# Altium project PCB_Game_consol.PrjPCB
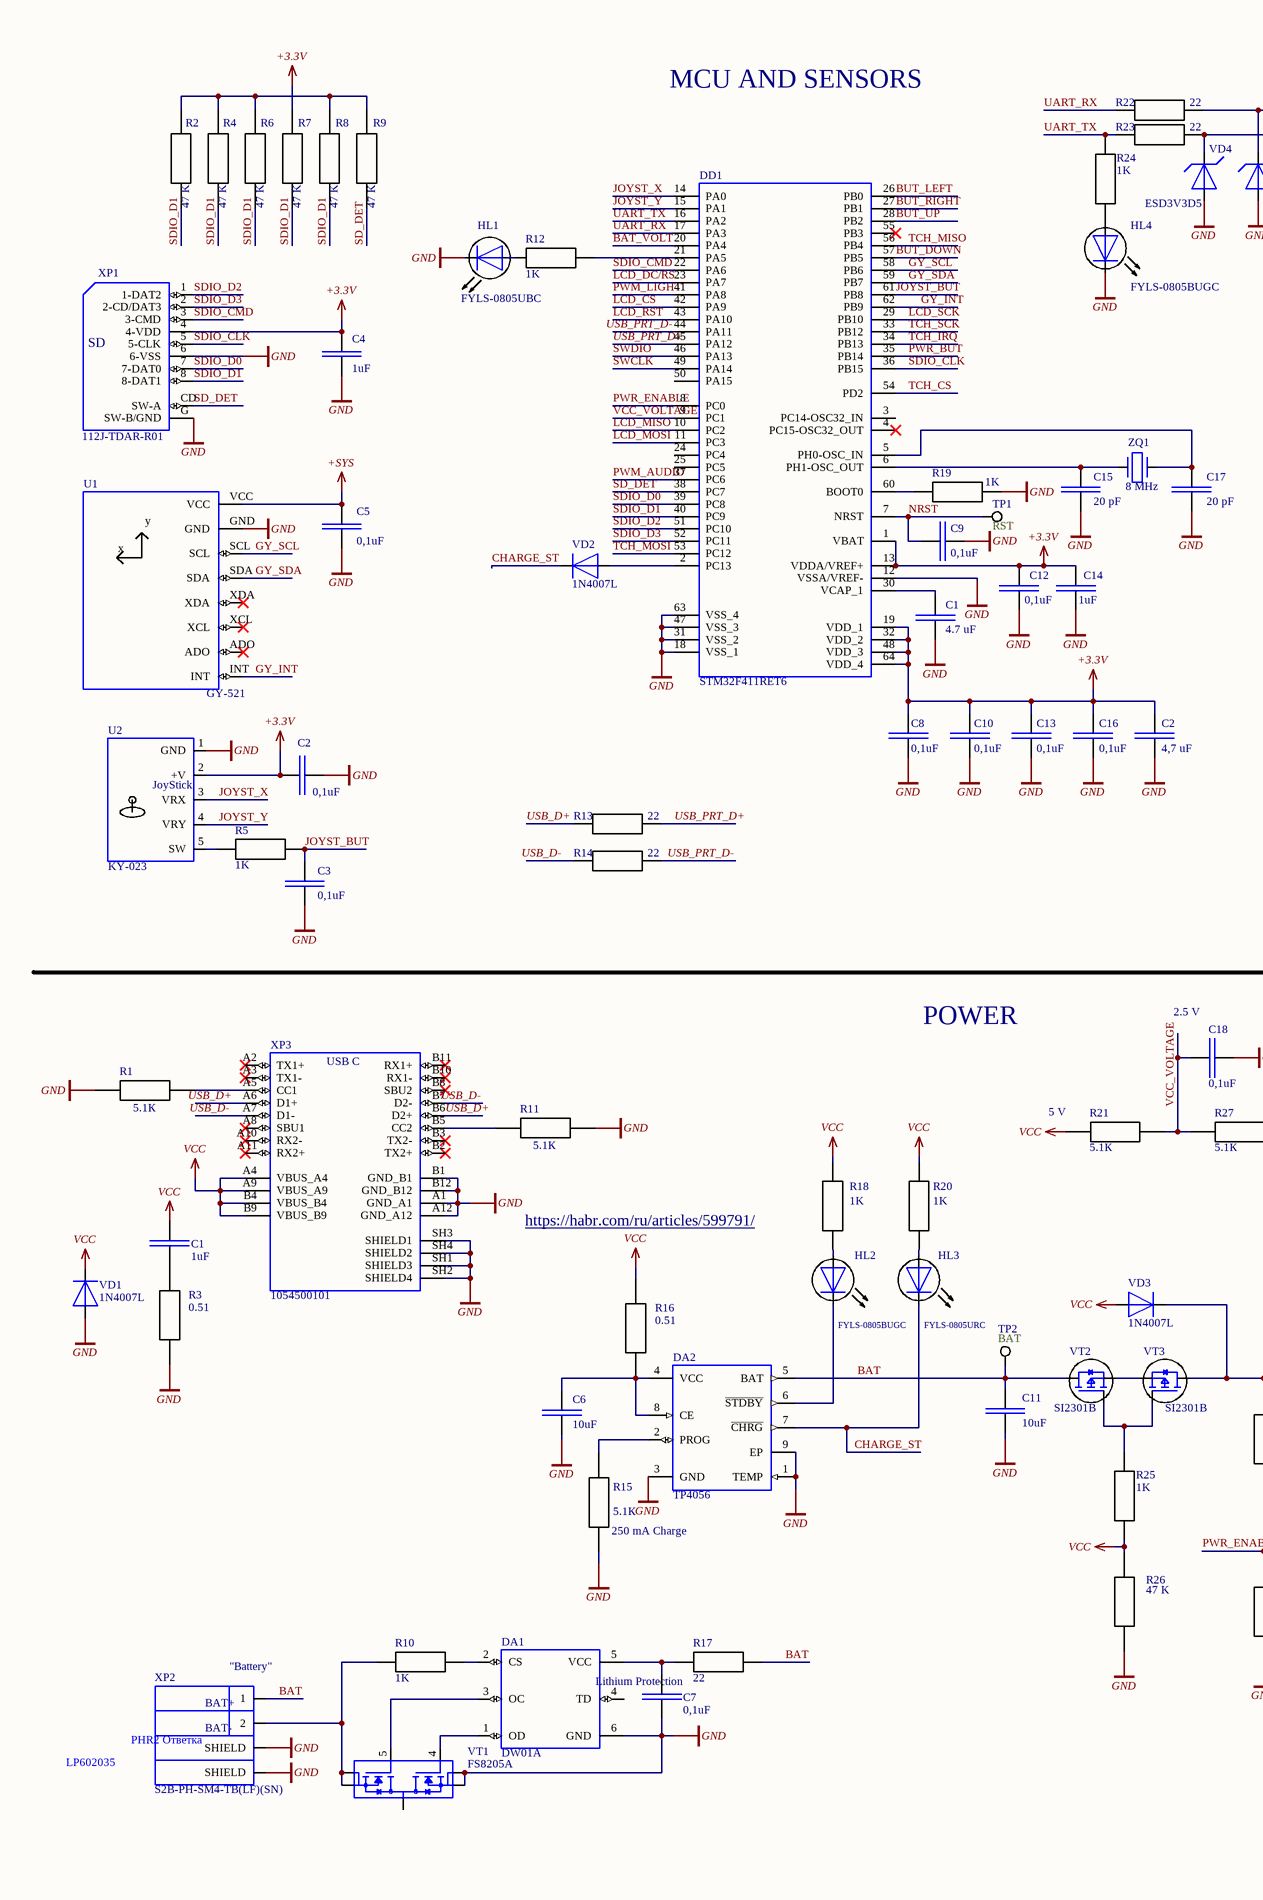
[diagram p0: Sheet_GameConsol.SchDoc, left]
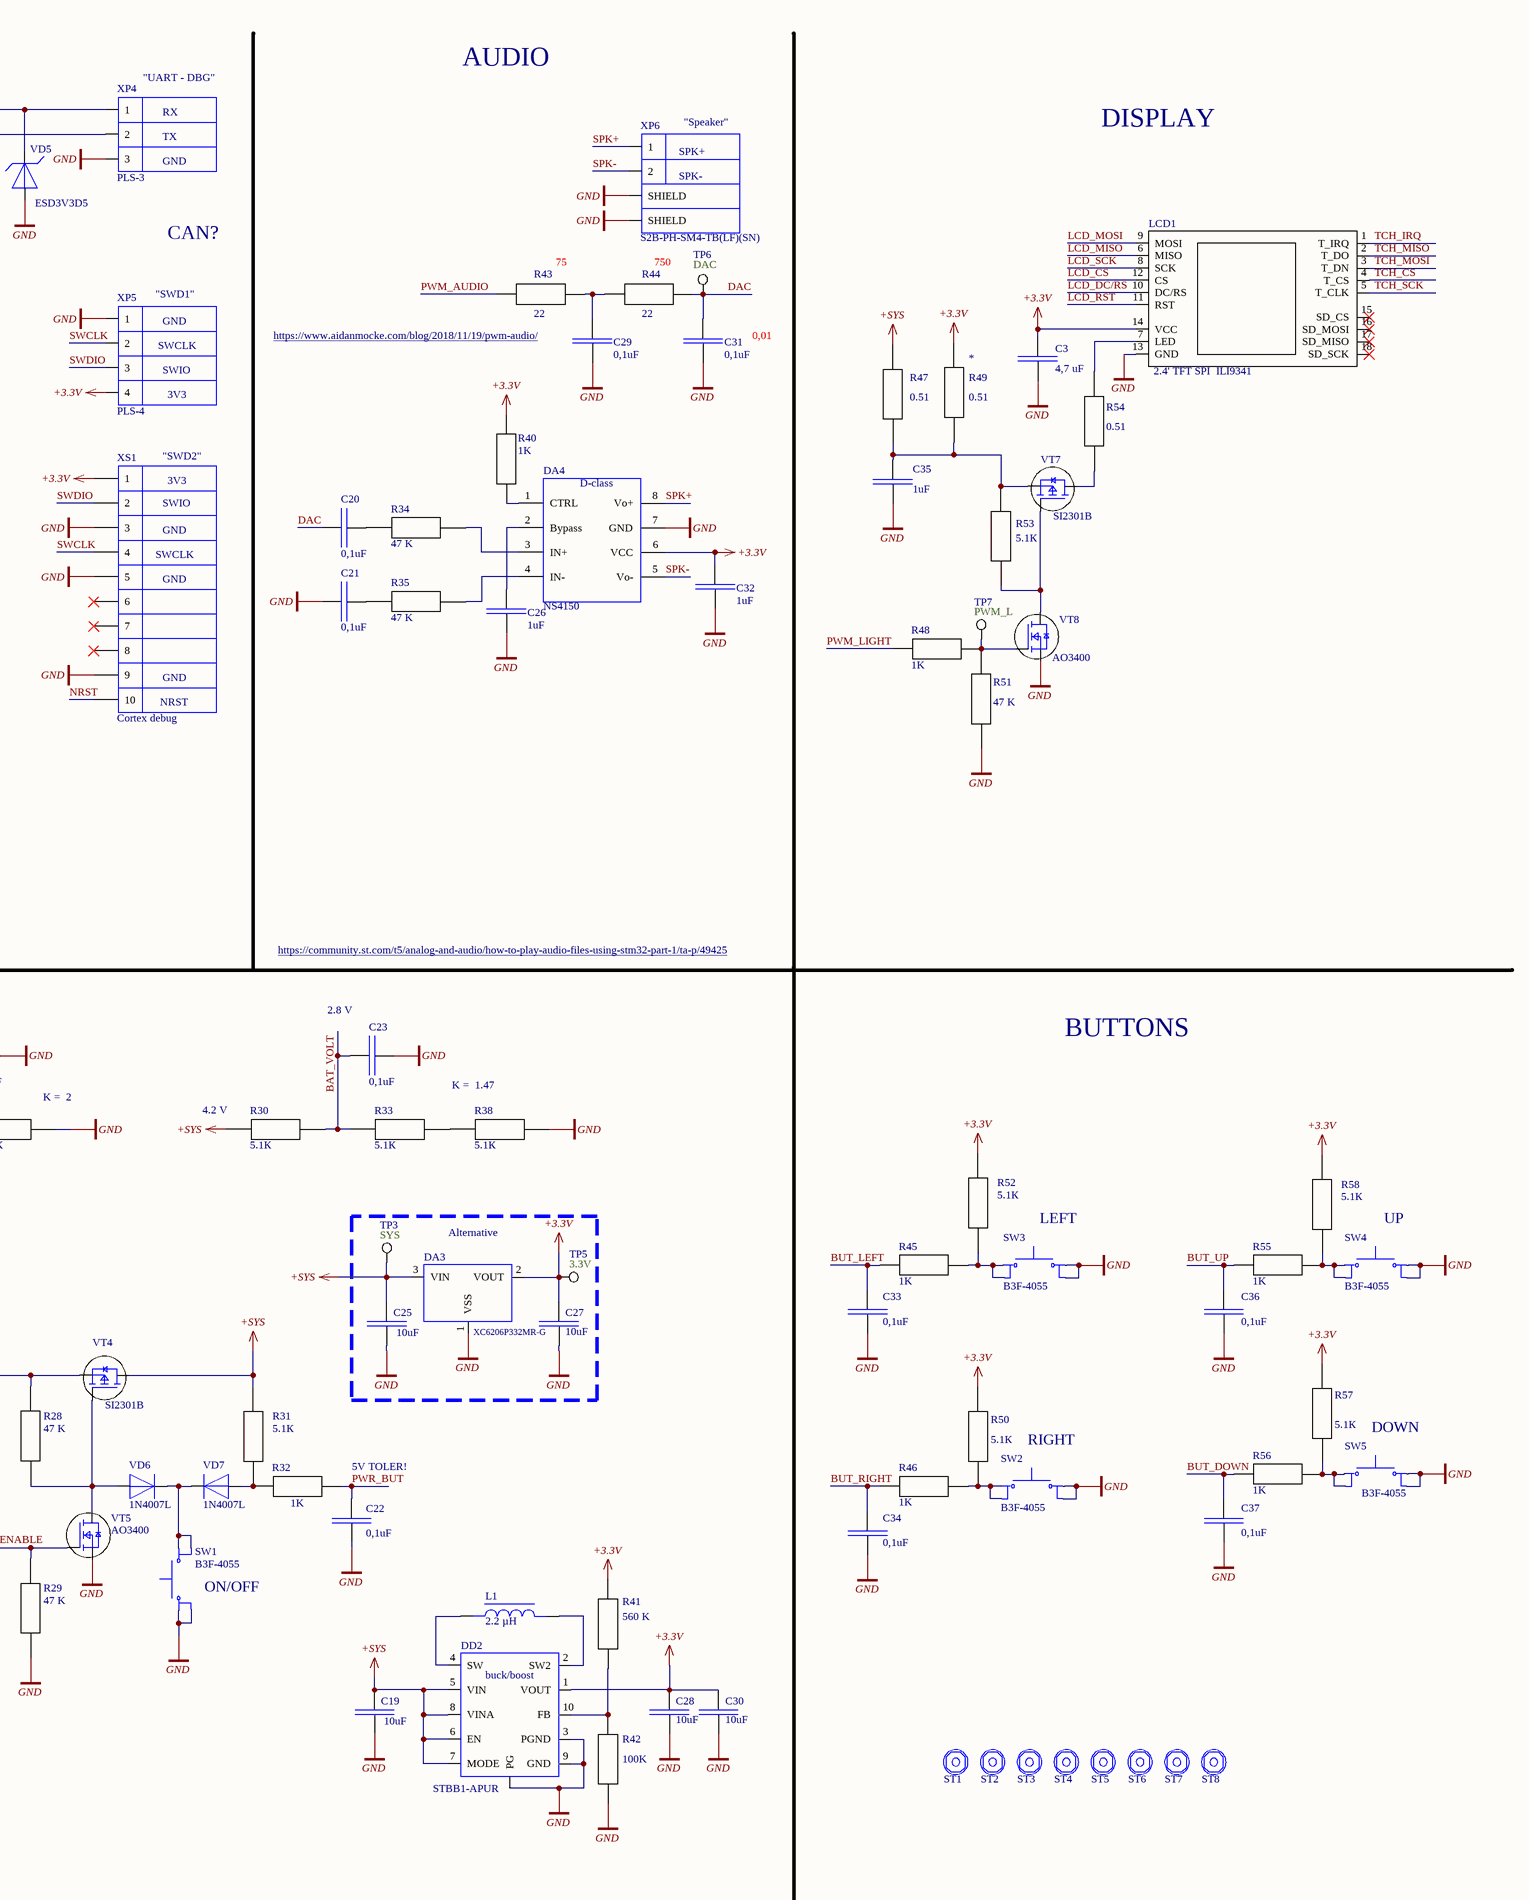
[diagram p1: Sheet_GameConsol.SchDoc, right]
1 sheet, 149 parts. Net scope: global (net labels, ports and power ports of the same name join across sheets).
Board file: PCB_Console.PcbDoc

## Sheet Sheet_GameConsol.SchDoc: Game Console
size A2; Organization: Altium Limited; Address4: Australia 2086; Time: 2023

### Parts
C1  1uF  [CAPC2012X70]
C2  0,1uF  [CAPC1608X90]
C3  0,1uF  [CAPC1608X90]
C4  1uF  [CAPC2012X70]
C5  0,1uF  [CAPC1608X90]
C6  10uF  [CAPC1608X90]
C7  0,1uF  [CAPC1608X90]
C8  0,1uF  [CAPC1608X90]
C9  0,1uF  [CAPC1608X90]
C10  0,1uF  [CAPC1608X90]
C11  10uF  [CAPC1608X90]
C12  0,1uF  [CAPC1608X90]
C13  0,1uF  [CAPC1608X90]
C14  1uF  [CAPC2012X70]
C15  20 pF  [CAPC2012X70]
C16  0,1uF  [CAPC1608X90]
C17  20 pF  [CAPC2012X70]
C18  0,1uF  [CAPC1608X90]
C19  10uF  [CAPC1608X90]
C20  0,1uF  [CAPC1608X90]
C21  0,1uF  [CAPC1608X90]
C22  0,1uF  [CAPC1608X90]
C23  0,1uF  [CAPC1608X90]
C25  10uF  [CAPC1608X90]
C26  1uF  [CAPC2012X70]
C27  10uF  [CAPC1608X90]
C28  10uF  [CAPC1608X90]
C29  0,1uF  [CAPC1608X90]
C30  10uF  [CAPC1608X90]
C31  0,1uF  [CAPC1608X90]
C32  1uF  [CAPC2012X70]
C33  0,1uF  [CAPC1608X90]
C34  0,1uF  [CAPC1608X90]
C35  1uF  [CAPC2012X70]
C36  0,1uF  [CAPC1608X90]
C37  0,1uF  [CAPC1608X90]
DA1  DW01A  [SOT23-6]
DA2  TP4056  [SOP127P600X175-9N]
DA3  XC6206P332MR-G  [SOT-23]
DA4  NS4150  [SOIC127P780X200-8N]
DD1  STM32F411RET6  [QFP50P1200X1200X160-64N]
DD2  STBB1-APUR  [10-VFDFN]
HL1  FYLS-0805UBC  [0805 Chip SMD LED]
HL2  FYLS-0805BUGC  [0805 Chip SMD LED]
HL3  FYLS-0805URC  [0805 Chip SMD LED]
HL4  FYLS-0805BUGC  [0805 Chip SMD LED]
L1  2.2 µH  [IND_VLCF4020T-2R2N1R7]
LCD1  2.4' TFT SPI  ILI9341  [ILI9341 TFT DISPLAY]
R1  5.1К  [RESC1607X60N]
R2  47 K  [0805_res]
R3  0.51  [0805_res]
R4  47 K  [0805_res]
R5  1K  [RESC1607X60N]
R6  47 K  [0805_res]
R7  47 K  [0805_res]
R8  47 K  [0805_res]
R9  47 K  [0805_res]
R10  1K  [RESC1607X60N]
R11  5.1К  [RESC1607X60N]
R12  1K  [RESC1607X60N]
R13  22  [RESC1607X60N]
R14  22  [RESC1607X60N]
R15  5.1К  [RESC1607X60N]
R16  0.51  [0805_res]
R17  22  [RESC1607X60N]
R18  1K  [RESC1607X60N]
R19  1K  [RESC1607X60N]
R20  1K  [RESC1607X60N]
R21  5.1К  [RESC1607X60N]
R22  22  [RESC1607X60N]
R23  22  [RESC1607X60N]
R24  1K  [RESC1607X60N]
R25  1K  [RESC1607X60N]
R26  47 K  [0805_res]
R27  5.1К  [RESC1607X60N]
R28  47 K  [0805_res]
R29  47 K  [0805_res]
R30  5.1К  [RESC1607X60N]
R31  5.1К  [RESC1607X60N]
R32  1K  [RESC1607X60N]
R33  5.1К  [RESC1607X60N]
R34  47 K  [0805_res]
R35  47 K  [0805_res]
R38  5.1К  [RESC1607X60N]
R40  1K  [RESC1607X60N]
R41  560 K  [0805_res]
R42  100K  [0805_res]
R43  22  [RESC1607X60N]
R44  22  [RESC1607X60N]
R45  1K  [RESC1607X60N]
R46  1K  [RESC1607X60N]
R47  0.51  [0805_res]
R48  1K  [RESC1607X60N]
R49  0.51  [0805_res]
R50  5.1К  [RESC1607X60N]
R51  47 K  [0805_res]
R52  5.1К  [RESC1607X60N]
R53  5.1К  [RESC1607X60N]
R54  0.51  [0805_res]
R55  1K  [RESC1607X60N]
R56  1K  [RESC1607X60N]
R57  5.1К  [RESC1607X60N]
R58  5.1К  [RESC1607X60N]
ST1  M3 Standoff 5+10mm  [Standoff_M3_5mm+10mm_pcb]  (value not drawn)
ST2  M3 Standoff 5+10mm  [Standoff_M3_5mm+10mm_pcb]  (value not drawn)
ST3  M3 Standoff 5+10mm  [Standoff_M3_5mm+10mm_pcb]  (value not drawn)
ST4  M3 Standoff 5+10mm  [Standoff_M3_5mm+10mm_pcb]  (value not drawn)
ST5  M3 Standoff 5+10mm  [Standoff_M3_5mm+10mm_pcb]  (value not drawn)
ST6  M3 Standoff 5+10mm  [Standoff_M3_5mm+10mm_pcb]  (value not drawn)
ST7  M3 Standoff 5+10mm  [Standoff_M3_5mm+10mm_pcb]  (value not drawn)
ST8  M3 Standoff 5+10mm  [Standoff_M3_5mm+10mm_pcb]  (value not drawn)
SW1  B3F-4055  [SW_B3F-4055]
SW2  B3F-4055  [SW_B3F-4055]
SW3  B3F-4055  [SW_B3F-4055]
SW4  B3F-4055  [SW_B3F-4055]
SW5  B3F-4055  [SW_B3F-4055]
TP1  RST  [Test Point]
TP2  BAT  [Test Point]
TP3  SYS  [Test Point]
TP5  3.3V  [Test Point]
TP6  DAC  [Test Point]
TP7  PWM_L  [Test Point]
U1  GY-521  [GY-521]  (value not drawn)
U2  KY-023  [KY-023_PCB]
VD1  1N4007L  [SOD3715X135N]
VD2  1N4007L  [SOD3715X135N]
VD3  1N4007L  [SOD3715X135N]
VD4  ESD3V3D5  [SOD-523_PCB]
VD5  ESD3V3D5  [SOD-523_PCB]
VD6  1N4007L  [SOD3715X135N]
VD7  1N4007L  [SOD3715X135N]
VT1  FS8205A  [SOP65P640X120-8N]
VT2  SI2301B  [SOT95P240X111-3N]
VT3  SI2301B  [SOT95P240X111-3N]
VT4  SI2301B  [SOT95P240X111-3N]
VT5  AO3400  [SOT95P240X111-3N]
VT7  SI2301B  [SOT95P240X111-3N]
VT8  AO3400  [SOT95P240X111-3N]
XP1  112J-TDAR-R01  [112J-TDAR-R01]
XP2  S2B-PH-SM4-TB(LF)(SN)  [JST_S2B-PH-SM4-TB(LF)(SN)]
XP3  1054500101  [MOLEX_1054500101]
XP4  PLS-3  [PLS-3_PCB]
XP5  PLS-4  [PLS-4_PCB]
XP6  S2B-PH-SM4-TB(LF)(SN)  [JST_S2B-PH-SM4-TB(LF)(SN)]
XS1  Cortex debug  [SAMTEC_FTSH-105-01-L-DV-K]
ZQ1  8 MHz  [HC-49SM_PCB]
С1  4.7 uF  [CAPC2012X70]
С2  4,7 uF  [CAPC2012X70]
С3  4,7 uF  [CAPC2012X70]

### Blocks framed on the sheet
Alternative: C25 C27 DA3 TP3 TP5

### Nets
+3.3V: C2.2 C4.2 C8.2 C10.2 C12.2 C13.2 C14.2 C16.2 C27.2 C28.2 C30.2 C32.1 DA3.2(VOUT) DA4.6(VCC) DD1.1(VBAT) DD1.13(VDDA/VREF+) DD1.19(VDD_1) DD1.32(VDD_2) DD1.48(VDD_3) DD1.64(VDD_4) DD2.1(VOUT) LCD1.14(VCC) R7.2 R40.1 R41.2 R49.2 R50.2 R52.2 R57.2 R58.2 TP5.1 U2.2(+V) XP1.4(4-VDD) XP5.4 XS1.1 С2.2 С3.2
+SYS: C5.2 C19.2 C25.2 DA3.3(VIN) DD2.5(VIN) DD2.6(EN) DD2.7(MODE) DD2.8(VINA) R30.1 R31.2 R47.2 TP3.1 U1.VCC VT4.3(D)
GND: C2.1 C3.1 C4.1 C5.1 C6.1 C7.1 C8.1 C9.1 C10.1 C11.1 C12.1 C13.1 C14.1 C15.1 C16.1 C17.1 C18.1 C19.1 C21.2 C22.1 C23.1 C25.1 C26.2 C27.1 C28.1 C29.1 C30.1 C31.1 C32.2 C33.1 C34.1 C35.1 C36.1 C37.1 DA1.6(GND) DA2.1(TEMP) DA2.3(GND) DA2.9(EP) DA3.1(VSS) DA4.7(GND) DD1.12(VSSA/VREF-) DD1.18(VSS_1) DD1.31(VSS_2) DD1.47(VSS_3) DD1.63(VSS_4) DD2.3(PGND) DD2.9(GND) DD2.PG HL1.C(K) HL4.C(K) LCD1.13(GND) R1.2 R3.1 R11.2 R15.1 R19.2 R26.1 R27.1 R29.1 R38.1 R42.1 R51.1 SW1.1(COM) SW1.2(COM) SW2.3(NO) SW2.4(NO) SW3.3(NO) SW3.4(NO) SW4.3(NO) SW4.4(NO) SW5.3(NO) SW5.4(NO) U1.GND U2.1(GND) VD1.A VD4.A VD5.A VT1.2(S1) VT1.3(S1) VT5.2(S) VT8.2(S) XP1.6(6-VSS) XP1.G(SW-B/GND) XP2.S1(SHIELD) XP2.S2(SHIELD) XP3.A1(GND_A1) XP3.A12(GND_A12) XP3.B1(GND_B1) XP3.B12(GND_B12) XP3.SH1(SHIELD3) XP3.SH2(SHIELD4) XP3.SH3(SHIELD1) XP3.SH4(SHIELD2) XP4.3 XP5.1 XP6.S1(SHIELD) XP6.S2(SHIELD) XS1.3 XS1.5 XS1.9 С1.2 С2.1 С3.1
VCC: C1.2 R16.2 R18.2 R20.2 R21.1 R25.1 R26.2 VD1.C(K) VD3.A XP3.A4(VBUS_A4) XP3.A9(VBUS_A9) XP3.B4(VBUS_B4) XP3.B9(VBUS_B9)
BAT: C11.2 DA2.5(BAT) R17.1 TP2.1 VT2.3(D) XP2.1
BAT_VOLT: C23.2 DD1.20(PA4) R30.2 R33.2
BUT_DOWN: C37.2 DD1.57(PB5) R56.1
BUT_LEFT: C33.2 DD1.26(PB0) R45.1
BUT_RIGHT: C34.2 DD1.27(PB1) R46.1
BUT_UP: C36.2 DD1.28(PB2) R55.1
CHARGE_ST: DA2.7(~{CHRG}) HL3.C(K) VD2.C(K)
DAC: C20.2 C31.2 R44.1 TP6.1
GY_INT: DD1.62(PB9) U1.INT
GY_SCL: DD1.58(PB6) U1.SCL
GY_SDA: DD1.59(PB7) U1.SDA
JOYST_BUT: C3.2 DD1.61(PB8) R5.1
JOYST_X: DD1.14(PA0) U2.3(VRX)
JOYST_Y: DD1.15(PA1) U2.4(VRY)
LCD_CS: DD1.42(PA9) LCD1.12(CS)
LCD_DC/RS: DD1.23(PA7) LCD1.10(DC/RS)
LCD_MISO: DD1.10(PC2) LCD1.6(MISO)
LCD_MOSI: DD1.11(PC3) LCD1.9(MOSI)
LCD_RST: DD1.43(PA10) LCD1.11(RST)
LCD_SCK: DD1.29(PB10) LCD1.8(SCK)
NRST: C9.2 DD1.7(NRST) TP1.1 XS1.10
PWM_AUDIO: DD1.37(PC6) R43.2
PWM_LIGHT: DD1.41(PA8) R48.2
PWR_BUT: C22.2 DD1.35(PB14) R32.2
PWR_ENABLE: DD1.8(PC0) R29.2 VT5.1(G)
SD_DET: DD1.38(PC7) R9.1 XP1.CD(SW-A)
SDIO_CLK: DD1.36(PB15) XP1.5(5-CLK)
SDIO_CMD: DD1.22(PA6) XP1.3(3-CMD)
SDIO_D0: DD1.39(PC8) XP1.7(7-DAT0)
SDIO_D1: DD1.40(PC9) R2.1 R4.1 R6.1 R7.1 R8.1 XP1.8(8-DAT1)
SDIO_D2: DD1.51(PC10) XP1.1(1-DAT2)
SDIO_D3: DD1.52(PC11) XP1.2(2-CD/DAT3)
SPK+: DA4.8(Vo+) XP6.1
SPK-: DA4.5(Vo-) XP6.2
SWCLK: DD1.49(PA14) XP5.2 XS1.4
SWDIO: DD1.46(PA13) XP5.3 XS1.2
TCH_CS: DD1.54(PD2) LCD1.4(T_CS)
TCH_IRQ: DD1.34(PB13) LCD1.1(T_IRQ)
TCH_MISO: DD1.56(PB4) LCD1.2(T_DO)
TCH_MOSI: DD1.53(PC12) LCD1.3(T_DN)
TCH_SCK: DD1.33(PB12) LCD1.5(T_CLK)
UART_RX: DD1.17(PA3) R22.1
UART_TX: DD1.16(PA2) R23.1 R24.2
USB_D+: R13.1 XP3.A6(D1+) XP3.B6(D2+)
USB_D-: R14.1 XP3.A7(D1-) XP3.B7(D2-)
USB_PRT_D+: DD1.45(PA12) R13.2
USB_PRT_D-: DD1.44(PA11) R14.2
VCC_VOLTAGE: C18.2 DD1.9(PC1) R21.2 R27.2
NetC1_1: C1.1 R3.2
NetC6_2: C6.2 DA2.4(VCC) DA2.8(CE) R16.1
NetC7_2: C7.2 DA1.5(VCC) R17.2
NetC15_2: C15.2 DD1.6(PH1-OSC_OUT) ZQ1.1
NetC17_2: C17.2 DD1.5(PH0-OSC_IN) ZQ1.2
NetC20_1: C20.1 R34.2
NetC21_1: C21.1 R35.2
NetC26_1: C26.1 DA4.2(Bypass)
NetC29_2: C29.2 R43.1 R44.2
NetC35_2: C35.2 R47.1 R49.1 R53.2 VT7.2(S)
NetDA1_1: DA1.1(OD) VT1.4(G1)
NetDA1_2: DA1.2(CS) R10.2
NetDA1_3: DA1.3(OC) VT1.5(G2)
NetDA2_2: DA2.2(PROG) R15.2
NetDA2_6: DA2.6(~{STDBY}) HL2.C(K)
NetDA4_1: DA4.1(CTRL) R40.2
NetDA4_3: DA4.3(IN+) R34.1
NetDA4_4: DA4.4(IN-) R35.1
NetDD1_2: DD1.2(PC13) VD2.A
NetDD1_21: DD1.21(PA5) R12.2
NetDD1_30: DD1.30(VCAP_1) С1.1
NetDD1_60: DD1.60(BOOT0) R19.1
NetDD2_2: DD2.2(SW2) L1.2
NetDD2_4: DD2.4(SW) L1.1
NetDD2_10: DD2.10(FB) R41.1 R42.2
NetHL1_A: HL1.A R12.1
NetHL2_A: HL2.A R18.1
NetHL3_A: HL3.A R20.1
NetHL4_A: HL4.A R24.1
NetLCD1_7: LCD1.7(LED) R54.2
NetR1_1: R1.1 XP3.A5(CC1)
NetR2_2: R2.2 R4.2 R6.2 R8.2 R9.2
NetR5_2: R5.2 U2.5(SW)
NetR10_1: R10.1 VT1.6(S2) VT1.7(S2) XP2.2
NetR11_1: R11.1 XP3.B5(CC2)
NetR22_2: R22.2 VD5.C(K) XP4.1
NetR23_2: R23.2 VD4.C(K) XP4.2
NetR25_2: R25.2 VT2.1(G) VT3.1(G)
NetR28_1: R28.1 VD6.A VT4.1(G) VT5.3(D)
NetR28_2: R28.2 VD3.C(K) VT3.3(D) VT4.2(S)
NetR31_1: R31.1 R32.1 VD7.A
NetR33_1: R33.1 R38.2
NetR45_2: R45.2 R52.1 SW3.1(COM) SW3.2(COM)
NetR46_2: R46.2 R50.1 SW2.1(COM) SW2.2(COM)
NetR48_1: R48.1 R51.2 TP7.1 VT8.1(G)
NetR53_1: R53.1 VT7.1(G) VT8.3(D)
NetR54_1: R54.1 VT7.3(D)
NetR55_2: R55.2 R58.1 SW4.1(COM) SW4.2(COM)
NetR56_2: R56.2 R57.1 SW5.1(COM) SW5.2(COM)
NetSW1_3: SW1.3(NO) SW1.4(NO) VD6.C(K) VD7.C(K)
NetVT1_1: VT1.1(D12) VT1.8(D12)
NetVT2_2: VT2.2(S) VT3.2(S)

Not connected (* = marked no-connect by the designer): DA1 4(TD); DD1 3(PC14-OSC32_IN) 4(PC15-OSC32_OUT)* 24(PC4) 25(PC5) 50(PA15) 55(PB3)*; LCD1 15(SD_CS)* 16(SD_MOSI)* 17(SD_MISO)* 18(SD_SCK)*; U1 ADO* XCL* XDA*; XP3 A2(TX1+)* A3(TX1-)* A8(SBU1)* A10(RX2-)* A11(RX2+)* B2(TX2+)* B3(TX2-)* B8(SBU2)* B10(RX1-)* B11(RX1+)*; XS1 6* 7* 8*

### Notes on the sheet
- MCU AND SENSORS
- (near XP4) "UART - DBG"
- AUDIO
- (near XP4) GND
- (near XP4) TX
- (near XP4) RX
- (near XP6) SPK+
- (near XP6) "Speaker"
- DISPLAY
- (near XP6) SPK-
- CAN?
- (near R43) 75
- 750
- (near XP5) "SWD1"
- (near XP5) SWCLK
- (near XP5) GND
- (near C29) https://www.aidanmocke.com/blog/2018/11/19/pwm-audio/
- 0,01
- (near XP5) SWIO
- (near XP5) 3V3
- (near R49) *
- "SWD2"
- (near XS1) GND
- (near XS1) SWIO
- (near XS1) 3V3
- (near XS1) SWCLK
- (near XS1) NRST
- https://community.st.com/t5/analog-and-audio/how-to-play-audio-files-using-stm32-part-1/ta-p/49425
- POWER
- (near C18) 2.5 V
- (near C23) 2.8 V
- BUTTONS
- (near R27) K =  2
- K =  1.47
- (near R21) 5 V
- (near R30) 4.2 V
- (near R18) https://habr.com/ru/articles/599791/
- (near SW3) LEFT
- (near SW4) UP
- 5V TOLER!
- RIGHT
- DOWN
- (near R15) 250 mA Charge
- (near SW1) ON/OFF
- (near XP2) "Battery"
- (near XP2) BAT+
- (near XP2) BAT-
- LP602035
- PHR2 Ответка
- Title
- Size:
- Date:
- File:
- A2
- Number:
- Time:
- Revision:
- Sheet
- of
- (in symbol 112J-TDAR-R01) SD
- (in symbol 1054500101) USB C
- (in symbol DW01A) Lithium Protection
- (in symbol GY-521) y; x
- (in symbol KY-023) JoyStick
- (in symbol NS4150) D-class
- (in symbol STBB1-APUR) buck/boost

### Library data of the parts
C1 C4 C14 C26 C32 C35 = CC0805KKX7R8BB105: CC0805KKX7R8BB105, Керамический ЧИП-конденсатор 0805 X7R 1мкФ ±10% 25В; MF: Yageo; Digi-Key_Part_Number: 311-1456-1-ND; Package: 0805 Yageo; Check_prices: https://www.snapeda.com/parts/CC0805KKX7R8BB105/Yageo/view-part/105544/?ref=eda; SnapEDA_Link: https://www.snapeda.com/parts/CC0805KKX7R8BB105/Yageo/view-part/105544/?ref=snap; MP: CC0805KKX7R8BB105; Value: *; Purchase-URL: https://pricing.snapeda.com/search/part/CC0805KKX7R8BB105/?ref=eda
C2 C3 C5 C7-C10 C12 C13 C16 C18 C20-C23 C29 C31 C33 C34 C36 C37 = CC0603KRX7R9BB104: CC0603KRX7R9BB104, Керамический ЧИП-конденсатор 0603 X7R 0.1мкФ ±10% 50В; MF: Yageo; Check_prices: https://www.snapeda.com/parts/CC0603KRX7R9BB104/Yageo/view-part/?ref=eda; Value: *; Purchase-URL: https://pricing.snapeda.com/search/part/CC0603KRX7R9BB104/?ref=eda; SnapEDA_Link: https://www.snapeda.com/parts/CC0603KRX7R9BB104/Yageo/view-part/?ref=snap; MP: CC0603KRX7R9BB104; Digi-Key_Part_Number: 311-1344-2-ND; Package: 0603 Yageo
C6 C11 C19 C25 C27 C28 C30 = CC0603MRX5R8BB106: Керамический ЧИП-конденсатор 0603 X5R 10мкФ ±20% 25В
C15 C17 = CC0805JRNPO9BN200: Керамический ЧИП-конденсатор 0805 NP0 20пФ ±5% 50В; MP: CC0805JRNPO9BN200
DA1 = DW01A: One Cell Lithium-ion/Polymer Battery Protection IC; MF: Fortune Semiconductor; SnapEDA_Link: https://www.snapeda.com/parts/DW01A/Fortune+Semiconductor/view-part/?ref=snap; Package: SOT-23-6 Fortune Semiconductor; Value: *; MP: DW01A; Check_prices: https://www.snapeda.com/parts/DW01A/Fortune+Semiconductor/view-part/?ref=eda
DA2 = TP4056: Complete single cell Li-Ion battery with a constant current / constant voltage linear charger; MF: NanJing Top Power ASIC Corp.; Check_prices: https://www.snapeda.com/parts/TP4056/NanJing+Top+Power+ASIC+Corp./view-part/?ref=eda; SnapEDA_Link: https://www.snapeda.com/parts/TP4056/NanJing+Top+Power+ASIC+Corp./view-part/?ref=snap; Price: None; Availability: Not in stock; Package: Package; MP: TP4056; Value: *
DA3 = XC6206P332MR-G: Linear Voltage Regulator IC Positive Fixed 1 Output 200mA SOT-23; MF: Torex; SnapEDA_Link: https://www.snapeda.com/parts/XC6206P332MR-G/Torex/view-part/?ref=snap; Availability: In Stock; Price: None; Check_prices: https://www.snapeda.com/parts/XC6206P332MR-G/Torex/view-part/?ref=eda; Value: *; Purchase-URL: https://pricing.snapeda.com/search/part/XC6206P332MR-G/?ref=eda; Package: SOT-23-3 Torex; MP: XC6206P332MR-G
DA4 = NS4150: General Purpose Amplifier 2 Circuit 8-SO; MF: Shenzhen Nsiway Tech; Package: SO-8; Value: *; MP: NS4150; Availability: Unavailable
DD1 = STM32F411RET6: 32-Bit MCU+DSP 512K Flash 100MHz LQFP64 STMicroelectronics STM32F411RET6, 32bit ARM Cortex M4 MCU, 100MHz, 512 kB Flash, 64-Pin LQFP; Geometry.Height: 1.6mm; Manufacturer_Name: STMicroelectronics; Manufacturer_Part_Number: STM32F411RET6; Mouser Part Number: 511-STM32F411RET6; Mouser Price/Stock: https://www.mouser.co.uk/ProductDetail/STMicroelectronics/STM32F411RET6?qs=pjMTYa9MTGWrHTmziD2M%2Fg%3D%3D; Arrow Part Number: STM32F411RET6; Arrow Price/Stock: https://www.arrow.com/en/products/stm32f411ret6/stmicroelectronics?region=europe; Datasheet Link: http://www.farnell.com/datasheets/2042639.pdf
DD2 = STBB1-APUR: Преобразователь постоянного тока вход 2,0 до 5,5 В, выход 1,2 до 5,5 В, 1А, КПД 94%; MP: STBB1-APUR
HL1 = FYLS-0805UBC: FYLS-0805UBC, Светодиод smd 2х1,25мм/синий/468нм/120мкд/прозрачный/130°; Price: None; MP: FYLS-0805UBC
HL2 HL4 = FYLS-0805BUGC: FYLS-0805BUGC, Светодиод smd 2х1,25мм/зеленый/570нм/40мкд/прозрачный/130°; MP: FYLS-0805URC; Price: None
HL3 = FYLS-0805URC: FYLS-0805URC, Светодиод smd 2х1,25мм/красный/631нм/80мкд/прозрачный/130°; Price: None; MP: FYLS-0805URC
L1 = VLCF4020T-2R2N1R7: 2.2 µH Shielded Wirewound Inductor 1.72 A 59mOhm Max; MF: TDK; SnapEDA_Link: https://www.snapeda.com/parts/VLCF4020T-2R2N1R7/TDK/view-part/?ref=snap; Availability: In Stock; Purchase-URL: https://pricing.snapeda.com/search/part/VLCF4020T-2R2N1R7/?ref=eda; Check_prices: https://www.snapeda.com/parts/VLCF4020T-2R2N1R7/TDK/view-part/?ref=eda; Value: *; Package: None; MP: VLCF4020T-2R2N1R7; Price: None
R1 R11 R15 R21 R27 R30 R31 R33 R38 R50 R52 R53 R57 R58 = RC0603FR-075K1L: RC0603FR-075K1L, Толстопленочный ЧИП-резистор 0603 5.1кОм ±1% 0.1Вт -55°С...+155°С; MF: Yageo; Value: *; MP: RC0603FR-075K1L; Digi-Key_Part_Number: 311-5.10KHRCT-ND; Purchase-URL: https://pricing.snapeda.com/search/part/RC0603FR-075K1L/?ref=eda; SnapEDA_Link: https://www.snapeda.com/parts/RC0603FR-075K1L/Yageo/view-part/106091/?ref=snap; Package: 0603 Yageo
R2 R4 R6-R9 R26 R28 R29 R34 R35 R51 = RC0805FR-0747KL: RC0805FR-0747KL, Толстопленочный ЧИП-резистор 0805 47кОм ±1% 0.125Вт -55°С...+155°С; Package: None; Price: None; Value: *; MP: RC0805FR-0747KL; Availability: Unavailable
R3 R16 R47 R49 R54 = RL0805FR-070R51L: Толстопленочный ЧИП-резистор 0805 0.51Ом ±1% 0.125Вт -55°С...+125°С; Package: None; Price: None; Value: *; MP: RL0805FR-070R51L; Availability: Unavailable
R5 R10 R12 R18-R20 R24 R25 R32 R40 R45 R46 R48 R55 R56 = RC0603JR-071KL: RC0603JR-071KL, Толстопленочный ЧИП-резистор 0603 1кОм ±5% 0.1Вт -55°С...+155°С; MP: RC0603JR-071KL
R13 R14 R17 R22 R23 R43 R44 = RC0603FR-0722RL: RC0603FR-0722RL, Толстопленочный ЧИП-резистор 0603 22Ом ±1% 0.1Вт -55°С...+155°С; MP: RC0603FR-0722RL
R41 = RC0805FR-07560KL: Толстопленочный ЧИП-резистор 0805 560кОм ±1% 0.125Вт -55°С...+155°С; Package: None; Price: None; Value: *; MP: RC0805FR-07560KL; Availability: Unavailable
R42 = RC0805FR-07100KL: Толстопленочный ЧИП-резистор 0805 100кОм ±1% 0.125Вт -55°С...+155°С; Package: None; Price: None; Value: *; MP: RC0805FR-07100KL; Availability: Unavailable
TP1-TP3 TP5-TP7 = Test Point: Test point 0.8 ММ
U1 = GY-521: Triple Axis Accelerometer Gyro Breakout; MF: GODREAM FORDREAM CO., LIMITED; Price: None; MP: GY-521; SnapEDA_Link: https://www.snapeda.com/parts/GY-521/GODREAM+FORDREAM+CO.%252C+LIMITED/view-part/?ref=snap; Package: Package; Availability: Not in stock; Check_prices: https://www.snapeda.com/parts/GY-521/GODREAM+FORDREAM+CO.%252C+LIMITED/view-part/?ref=eda; Value: *
U2 = KY-023: Двухосевой джойстик KY-023; MP: KY-023
VD1-VD3 VD6 VD7 = 1N4007L: 1N4007L, Диод общего применения 1кВ 1A SOD-123; MP: 1N4148W-13-F; MF: Diodes Inc.; Price: None; Package: SOD-123 Diodes Inc.; Value: *; Availability: Unavailable; SnapEDA_Link: https://www.snapeda.com/parts/1N4148W-13-F/Diodes%20Inc./view-part/9226/?ref=snap
VD4 VD5 = ESD3V3D5: TVS диод защитный однонаправленный 5В SOD523; Value: *; MP: ESD3V3D5
VT1 = FS8205A: 20V 6A 25mΩ@4.5V; MF: Fortune Semiconductor; MP: FS8205A; Value: *; Availability: Not in stock; Package: Package; Price: None; SnapEDA_Link: https://www.snapeda.com/parts/FS8205A/Fortune+Semiconductor/view-part/?ref=snap; Check_prices: https://www.snapeda.com/parts/FS8205A/Fortune+Semiconductor/view-part/?ref=eda
VT2-VT4 VT7 = SI2301B: SI2301B, Транзистор полевой MOSFET P-канальный 20В 2.5A 120мОм; MP: altium_native_batch; Package: None; Price: None; Availability: Unavailable; Value: *
VT5 VT8 = AO3400: Транзистор полевой N-канальный 30В 5.8А 0.9Вт; MP: altium_native_batch; Package: None; Price: None; Availability: Unavailable; Value: *
XP1 = 112J-TDAR-R01: MicroSD сокет вставной; MF: Attend; Package: None; MP: 112J-TDAR-R01; Value: *; Availability: In Stock; SnapEDA_Link: https://www.snapeda.com/parts/112J-TDAR-R01/Attend/view-part/?ref=snap; Price: None; Check_prices: https://www.snapeda.com/parts/112J-TDAR-R01/Attend/view-part/?ref=eda
XP2 XP6 = S2B-PH-SM4-TB(LF)(SN): Connector Header Surface Mount, Right Angle 2 position 0.079 (2.00mm); MF: JST Sales; Value: *; SnapEDA_Link: https://www.snapeda.com/parts/S2B-PH-SM4-TB(LF)(SN)/JST+Sales+America+Inc./view-part/?ref=snap; Purchase-URL: https://pricing.snapeda.com/search/part/S2B-PH-SM4-TB(LF)(SN)/?ref=eda; Check_prices: https://www.snapeda.com/parts/S2B-PH-SM4-TB(LF)(SN)/JST+Sales+America+Inc./view-part/?ref=eda; Digi-Key_Part_Number: 455-1749-2-ND; Package: None; MP: S2B-PH-SM4-TB(LF)(SN)
XP3 = 1054500101: USB-C (USB TYPE-C) USB 3.2 Gen 2 (USB 3.1 Gen 2, Superspeed + (USB 3.1)) Receptacle Connector 24 Position Surface Mount, Right Angle; Through Hole; MF: Molex; SnapEDA_Link: https://www.snapeda.com/parts/1054500101/Molex/view-part/?ref=snap; Package: None; Value: *; MP: 1054500101; Check_prices: https://www.snapeda.com/parts/1054500101/Molex/view-part/?ref=eda
XS1 = FTSH-105-01-L-DV-K: Connector Header Surface Mount 10 position 0.050" (1.27mm)  <a href="https://pricing.snapeda.com/parts/FTSH-105-01-L-DV-K/Samtec/view-part?ref=eda">Check availability</a>; MF: Samtec; Package: None; Price: None; Value: *; MP: FTSH-105-01-L-DV-K; Availability: Unavailable
ZQ1 = HC-49SM 8.000 МГц: 8.000 МГц HC-49SM, Кварцевый резонатор; MP: HC-49SM 8.000 МГц
С1-С3 = CL21A475KAQNNNE: Керамический ЧИП-конденсатор 0805 X5R 4.7мкФ ±10% 25В; MP: CL21A475KAQNNNE
LCD1 = 2.4' TFT SPI  ILI9341: MP: 2.4' TFT SPI  ILI9341
ST1-ST8 = M3 Standoff 5+10mm: MP: Standoff
SW1-SW5 = B3F-4055: Price: None; MP: B3F-4055; Availability: Unavailable; Value: *; Package: None
XP4 = PLS-3: MP: PLS-3
XP5 = PLS-4: MP: PLS-4